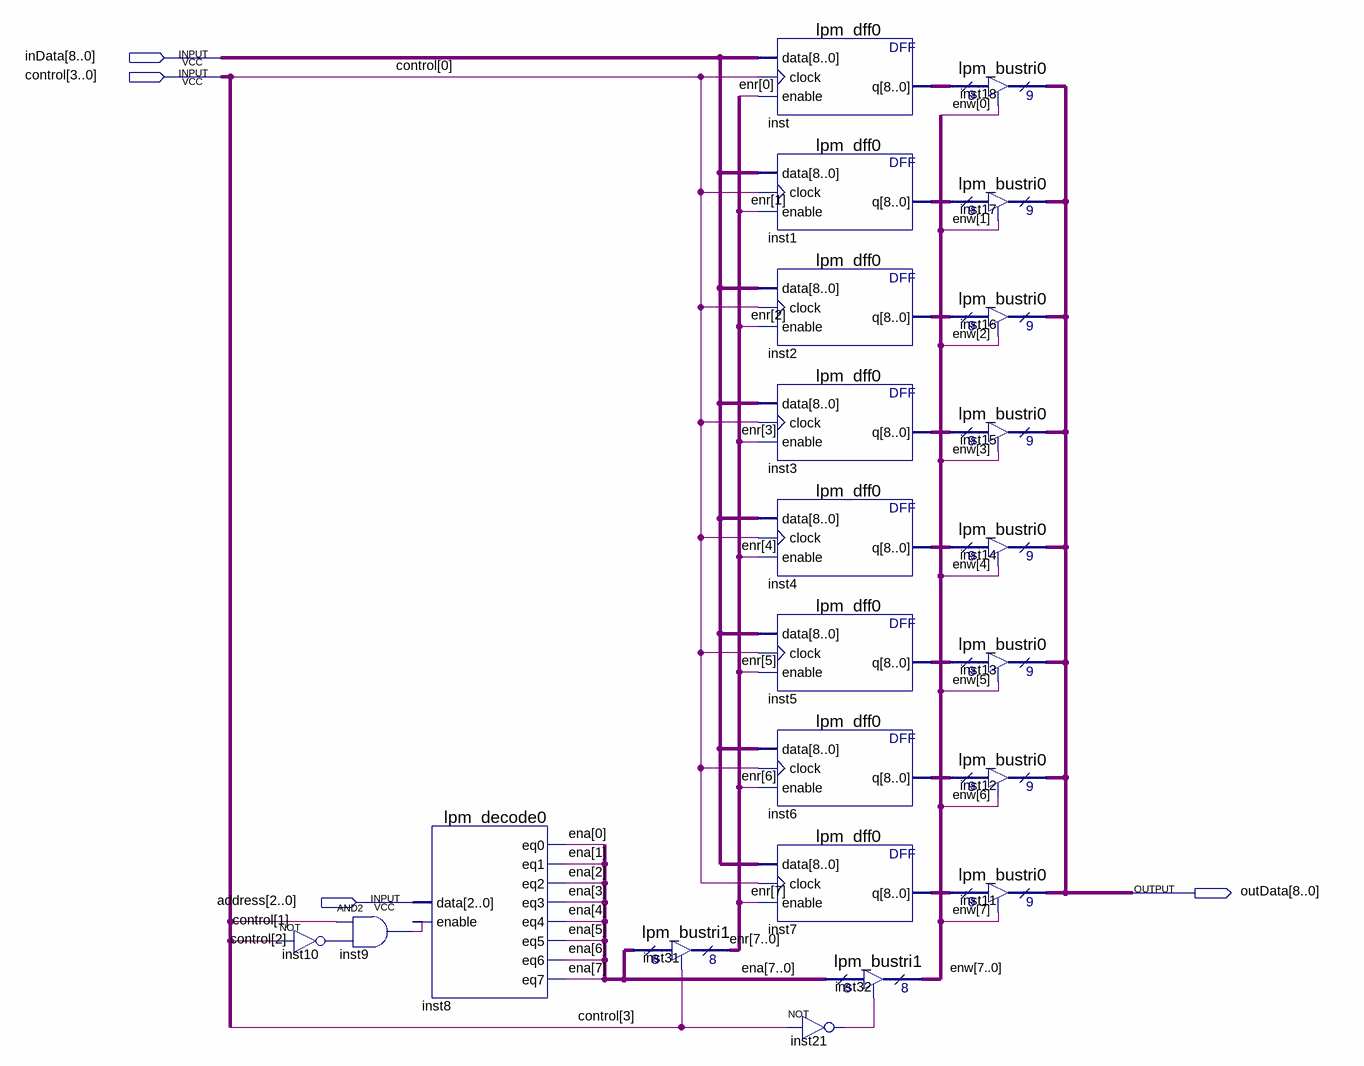
[diagram p0: schematic sheet]
// Quartus schematic REG.bdf as structural Verilog: 22 symbols, 4 pins
module REG (
  input  [8:0] inData,
  input  [3:0] control,
  input  [2:0] address,
  output [8:0] outData
);

  wire inst9_out, inst10_out, inst21_out;
  wire [7:0] ena, enr, enw;
  wire [8:0] inst1_q, inst2_q, inst3_q, inst4_q, inst5_q, inst6_q, inst7_q, inst_q;

  not inst10 (inst10_out, control[2]);
  and inst9 (inst9_out, control[1], inst10_out);
  lpm_decode0 inst8 (
    .data(address), .enable(inst9_out), .eq0(ena[0]), .eq1(ena[1]), .eq2(ena[2]), .eq3(ena[3]), .eq4(ena[4]),
    .eq5(ena[5]), .eq6(ena[6]), .eq7(ena[7]));
  lpm_bustri1 inst31 (.enabledt(control[3]), .data(ena), .tridata(enr));
  lpm_dff0 inst (.data(inData), .clock(control[0]), .enable(enr[0]), .q(inst_q));
  lpm_dff0 inst1 (.data(inData), .clock(control[0]), .enable(enr[1]), .q(inst1_q));
  lpm_dff0 inst2 (.data(inData), .clock(control[0]), .enable(enr[2]), .q(inst2_q));
  lpm_dff0 inst3 (.data(inData), .clock(control[0]), .enable(enr[3]), .q(inst3_q));
  lpm_dff0 inst4 (.data(inData), .clock(control[0]), .enable(enr[4]), .q(inst4_q));
  lpm_dff0 inst5 (.data(inData), .clock(control[0]), .enable(enr[5]), .q(inst5_q));
  lpm_dff0 inst6 (.data(inData), .clock(control[0]), .enable(enr[6]), .q(inst6_q));
  lpm_dff0 inst7 (.data(inData), .clock(control[0]), .enable(enr[7]), .q(inst7_q));
  not inst21 (inst21_out, control[3]);
  lpm_bustri1 inst32 (.enabledt(inst21_out), .data(ena), .tridata(enw));
  lpm_bustri0 inst18 (.enabledt(enw[0]), .data(inst_q), .tridata(outData));
  lpm_bustri0 inst17 (.enabledt(enw[1]), .data(inst1_q), .tridata(outData));
  lpm_bustri0 inst16 (.enabledt(enw[2]), .data(inst2_q), .tridata(outData));
  lpm_bustri0 inst15 (.enabledt(enw[3]), .data(inst3_q), .tridata(outData));
  lpm_bustri0 inst14 (.enabledt(enw[4]), .data(inst4_q), .tridata(outData));
  lpm_bustri0 inst13 (.enabledt(enw[5]), .data(inst5_q), .tridata(outData));
  lpm_bustri0 inst12 (.enabledt(enw[6]), .data(inst6_q), .tridata(outData));
  lpm_bustri0 inst11 (.enabledt(enw[7]), .data(inst7_q), .tridata(outData));
endmodule
